# EAGLE schematic esp32-thing (EAGLE 9.5.2)
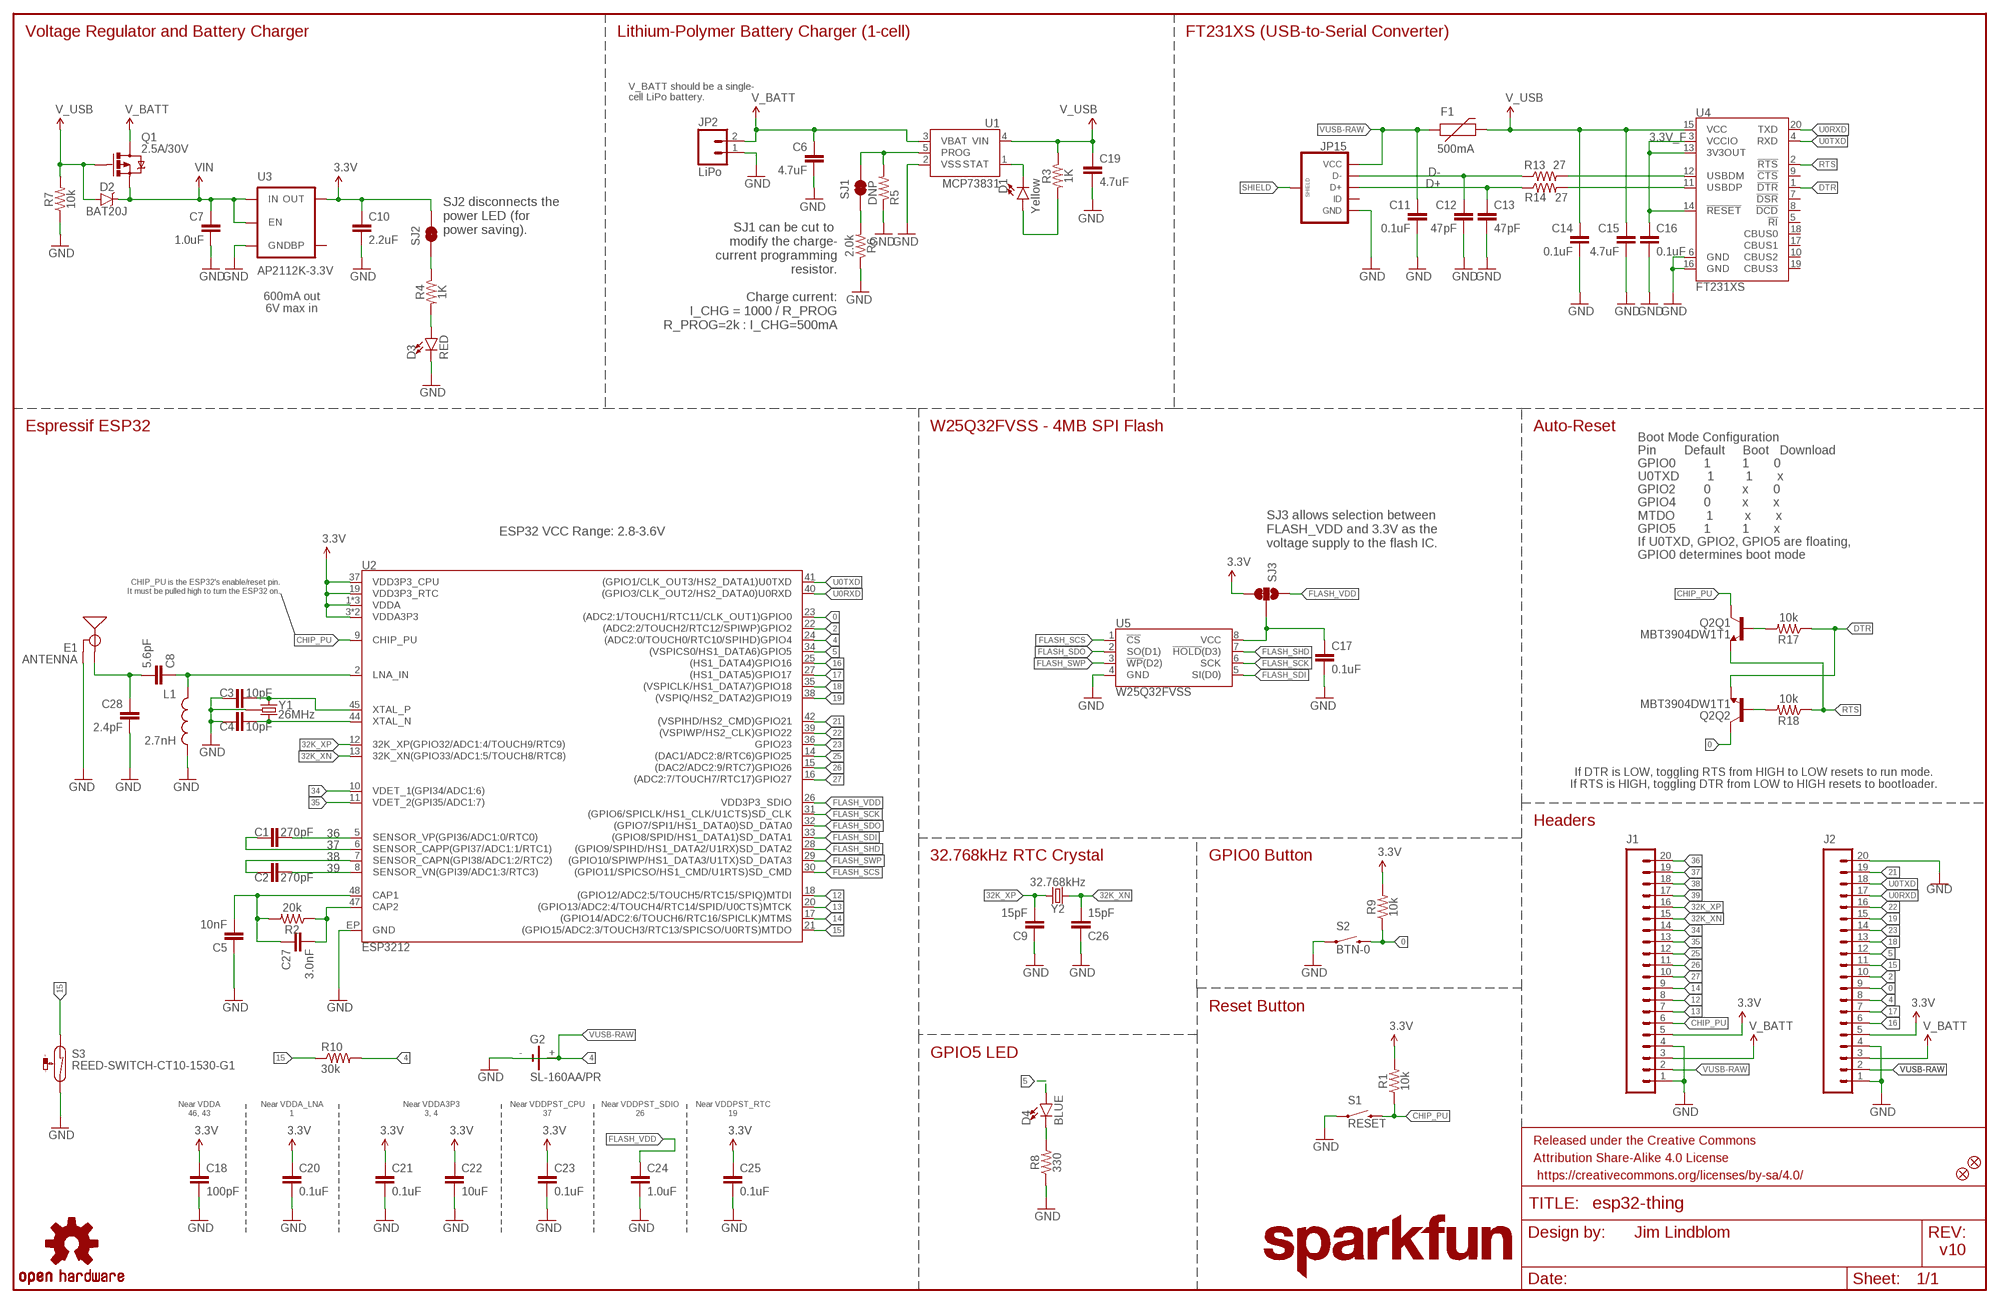
[diagram p0: schematic, sheet 1]

## Parts
C1  270pF  270PF-50V-5%(0603)  [0603]
C2  270pF  270PF-50V-5%(0603)  [0603]
C3  10pF  10PF-0603-50V-5%  [0603]
C4  10pF  10PF-0603-50V-5%  [0603]
C5  10nF  10NF-0603-50V-10%  [0603]
C6  4.7uF  4.7UF0603  [0603]
C7  1.0uF  1.0UF-0805-25V-(+80/-20%)  [0805]
C8  5.6pF  5.6PF-50V-5%(0603)  [0603]
C9  15pF  15PF-0603-50V-5%  [0603]
C10  2.2uF  2.2UF-0603-10V-20%  [0603]
C11  0.1uF  0.1UF-0603-25V-(+80/-20%)  [0603]
C12  47pF  47PF-0603-50V-5%  [0603]
C13  47pF  47PF-0603-50V-5%  [0603]
C14  0.1uF  0.1UF-0603-25V-(+80/-20%)  [0603]
C15  4.7uF  4.7UF-6.3V-10%(0603)0603  [0603-CAP]
C16  0.1uF  0.1UF-0603-25V-(+80/-20%)  [0603]
C17  0.1uF  0.1UF-0603-25V-(+80/-20%)  [0603]
C18  100pF  100PF-0603-50V-5%  [0603]
C19  4.7uF  4.7UF0603  [0603]
C20  0.1uF  0.1UF-0603-25V-(+80/-20%)  [0603]
C21  0.1uF  0.1UF-0603-25V-(+80/-20%)  [0603]
C22  10uF  10UF-0603-6.3V-20%  [0603]
C23  0.1uF  0.1UF-0603-25V-(+80/-20%)  [0603]
C24  1.0uF  1.0UF-0603-16V-10%  [0603]
C25  0.1uF  0.1UF-0603-25V-(+80/-20%)  [0603]
C26  15pF  15PF-0603-50V-5%  [0603]
C27  3.0nF  3.0NF-0603-50V-5%  [0603]
C28  2.4pF  2.4PF-0603-50V-5%  [0603]
D1  Yellow  LED-YELLOW0603  [LED-0603]
D2  BAT20J  DIODE-SCHOTTKY-BAT20J  [SOD-323]
D3  RED  LED-RED0603  [LED-0603]
D4  BLUE  LED-BLUE0603  [LED-0603]
E1  ANTENNA  ANTENNATRACE-TUNED  [TRACE_ANTENNA_2.4GHZ_25.7MM_TUNED]
F1  500mA  PTCSMD  [PTC-1206]
FD1  FIDUCIALUFIDUCIAL  [MICRO-FIDUCIAL]
FD2  FIDUCIALUFIDUCIAL  [MICRO-FIDUCIAL]
FRAME1  FRAME-LEDGER  [CREATIVE_COMMONS]
G2  SL-160AA/PR  [SL-160AA/PR]
J1  M20NOSILK  [1X20_NOSILK]
J2  M20NOSILK  [1X20_NOSILK]
JP2  LiPo  M02JST-PTH-2  [JST-2-PTH]
JP15  USB_MICROB_PLUGCONN-11752  [USB-B-MICRO-SMD_V03]
L1  2.7nH  INDUCTOR0603  [0603]
LOGO1  SFE_LOGO_NAME.2_INCH  [SFE_LOGO_NAME_.2]
LOGO2  OSHW-LOGOMINI  [OSHW-LOGO-MINI]
LOGO3  SFE_LOGO_NAME.2_INCH  [SFE_LOGO_NAME_.2]
Q1  2.5A/30V  MOSFET-PCHANNELDMG2307L  [SOT23-3]
Q2  MBT3904DW1T1  [SC70-6]
R1  10k  10KOHM-1/10W-1%(0603)0603  [0603]
R2  20k  20KOHM-0603-1/10W-1%  [0603]
R3  1K  1KOHM-1/10W-1%(0603)  [0603]
R4  1K  1KOHM-1/10W-1%(0603)  [0603]
R5  DNP  RESISTORPTH-1/6W  [1/6W-RES]
R6  2.0k  2.0KOHM1/10W5%(0603)  [0603]
R7  10k  10KOHM-0603-1/10W-1%  [0603]
R8  330  330OHM1/10W1%(0603)  [0603]
R9  10k  10KOHM-1/10W-1%(0603)0603  [0603]
R10  30k  R-US_M0805  [M0805]
R13  27  27OHM1/10W1%(0603)0603-RES  [0603]
R14  27  27OHM1/10W1%(0603)0603-RES  [0603]
R17  10k  10KOHM-0603-1/10W-1%  [0603]
R18  10k  10KOHM-0603-1/10W-1%  [0603]
S1  RESET  SWITCH-MOMENTARY-2SMD-4.6X2.8MM  [TACTILE_SWITCH_SMD_4.6X2.8MM]
S2  BTN-0  SWITCH-MOMENTARY-2SMD-4.6X2.8MM  [TACTILE_SWITCH_SMD_4.6X2.8MM]
S3  REED-SWITCH-CT10-1530-G1  [CT10-G1]
SJ1  JUMPER-PAD-2-NC_BY_TRACE  [PAD-JUMPER-2-NC_BY_TRACE_YES_SILK]
SJ2  JUMPER-PAD-2-NC_BY_TRACE  [PAD-JUMPER-2-NC_BY_TRACE_YES_SILK]
SJ3  JUMPER-PAD-3-2OF3_NC_BY_TRACE_SMALL  [PAD-JUMPER-3-2OF3_NC_BY_TRACE_YES_SILK_FULL_BOX]
U1  MCP73831  [SOT23-5]
U2  ESP3212  [QFN48-0.4MM]
U3  AP2112K-3.3V  V_REG_LDOSMD  [SOT23-5]
U4  FT231XS  [SSOP20_L]
U5  W25Q32FVSS  [SOIC-8]
Y1  26MHz  CRYSTAL-GROUNDED3.2X2.5  [CRYSTAL-SMD-3.2X2.5]
Y2  32.768kHz  CRYSTAL-32.768KHZSMD-3.2X1.5  [CRYSTAL-SMD-3.2X1.5MM]

## Nets
0: J2.9 Q2.6(Q2:C) R9.1 S2.3 S2.4 U2.23((ADC2:1/TOUCH1/RTC11/CLK_OUT1)GPIO0)
2: J2.10 U2.22((ADC2:2/TOUCH2/RTC12/SPIWP)GPIO2)
3.3V: C10.1 C18.1 C20.1 C21.1 C22.1 C23.1 C25.1 J1.5 J2.5 R1.2 R9.2 SJ2.2 SJ3.3 U2.1(VDDA) U2.3(VDDA3P3) U2.4(VDDA3P3) U2.19(VDD3P3_RTC) U2.37(VDD3P3_CPU) U2.43(VDDA) U2.46(VDDA) U3.5(OUT)
3.3V_F: C16.1 U4.3(VCCIO) U4.13(3V3OUT) U4.14(!RESET)
4: J2.8 U2.24((ADC2:0/TOUCH0/RTC10/SPIHD)GPIO4)
5: D4.A J2.12 U2.34((VSPICS0/HS1_DATA6)GPIO5)
12: J1.8 U2.18((GPIO12/ADC2:5/TOUCH5/RTC15/SPIQ)MTDI)
13: J1.7 U2.20((GPIO13/ADC2:4/TOUCH4/RTC14/SPID/U0CTS)MTCK)
14: J1.9 U2.17((GPIO14/ADC2:6/TOUCH6/RTC16/SPICLK)MTMS)
15: J2.11 U2.21((GPIO15/ADC2:3/TOUCH3/RTC13/SPICSO/U0RTS)MTDO)
16: J2.6 U2.25((HS1_DATA4)GPIO16)
17: J2.7 U2.27((HS1_DATA5)GPIO17)
18: J2.13 U2.35((VSPICLK/HS1_DATA7)GPIO18)
19: J2.15 U2.38((VSPIQ/HS2_DATA2)GPIO19)
21: J2.19 U2.42((VSPIHD/HS2_CMD)GPIO21)
22: J2.16 U2.39((VSPIWP/HS2_CLK)GPIO22)
23: J2.14 U2.36(GPIO23)
25: J1.12 U2.14((DAC1/ADC2:8/RTC6)GPIO25)
26: J1.11 U2.15((DAC2/ADC2:9/RTC7)GPIO26)
27: J1.10 U2.16((ADC2:7/TOUCH7/RTC17)GPIO27)
32K_XN: C26.2 J1.15 U2.13(32K_XN(GPIO33/ADC1:5/TOUCH8/RTC8)) Y2.P$2
32K_XP: C9.2 J1.16 U2.12(32K_XP(GPIO32/ADC1:4/TOUCH9/RTC9)) Y2.P$1
34: J1.14 U2.10(VDET_1(GPI34/ADC1:6))
35: J1.13 U2.11(VDET_2(GPI35/ADC1:7))
36: C1.2 J1.20 U2.5(SENSOR_VP(GPI36/ADC1:0/RTC0))
37: C1.1 J1.19 U2.6(SENSOR_CAPP(GPI37/ADC1:1/RTC1))
38: C2.1 J1.18 U2.7(SENSOR_CAPN(GPI38/ADC1:2/RTC2))
39: C2.2 J1.17 U2.8(SENSOR_VN(GPI39/ADC1:3/RTC3))
CAP_10N: C5.2 C27.1 R2.2 U2.48(CAP1)
CHIP_PU: J1.6 Q2.3(Q1:C) R1.1 S1.3 S1.4 U2.9(CHIP_PU)
D+: C13.1 JP15.D+ R14.1
D-: C12.1 JP15.D- R13.1
DTR: Q2.1(Q2:E) R17.1 U4.1(!DTR)
FLASH_SCK: U2.31((GPIO6/SPICLK/HS1_CLK/U1CTS)SD_CLK) U5.6(SCK)
FLASH_SCS: U2.30((GPIO11/SPICSO/HS1_CMD/U1RTS)SD_CMD) U5.1(!CS!)
FLASH_SDI: U2.33((GPIO8/SPID/HS1_DATA1)SD_DATA1) U5.5(SI(D0))
FLASH_SDO: U2.32((GPIO7/SPI1/HS1_DATA0)SD_DATA0) U5.2(SO(D1))
FLASH_SHD: U2.28((GPIO9/SPIHD/HS1_DATA2/U1RX)SD_DATA2) U5.7(!HOLD!(D3))
FLASH_SWP: U2.29((GPIO10/SPIWP/HS1_DATA3/U1TX)SD_DATA3) U5.3(!WP!(D2))
FLASH_VDD: C24.1 SJ3.1 U2.26(VDD3P3_SDIO)
GND: C3.1 C4.1 C5.1 C6.2 C7.2 C9.1 C10.2 C11.2 C12.2 C13.2 C14.2 C15.2 C16.2 C17.2 C18.2 C19.2 C20.2 C21.2 C22.2 C23.2 C24.2 C25.2 C26.1 C28.2 D3.C E1.GND E1.GND2(GND) G2.+ G2.- J1.1 J1.4 J2.1 J2.4 J2.20 JP2.1 JP15.GND L1.2 R5.1 R6.1 R7.1 R8.1 S1.1 S1.2 S2.1 S2.2 S3.2 U1.2(VSS) U2.EP(GND) U3.2(GND) U4.6(GND) U4.16(GND) U5.4(GND) Y1.2(GND) Y1.4(GND)
LNA_IN: C8.1 L1.1 U2.2(LNA_IN)
N$1: D4.C R8.2
N$2: D3.A R4.2
N$3: R4.1 SJ2.1
N$4: C27.2 R2.1 U2.47(CAP2)
N$5: R10.2
N$6: R10.1
N$7: R13.2 U4.12(USBDM)
N$8: R14.2 U4.11(USBDP)
N$9: D1.C U1.1(STAT)
N$10: Q2.5(Q1:B) R17.2
N$11: C17.1 SJ3.2 U5.8(VCC)
N$12: Q2.2(Q2:B) R18.2
N$13: C3.2 U2.45(XTAL_P) Y1.1
N$14: R5.2 SJ1.2 U1.5(PROG)
N$15: C4.2 U2.44(XTAL_N) Y1.3
N$16: R6.2 SJ1.1
N$17: D1.A R3.2
N$18: S3.1
RTS: Q2.4(Q1:E) R18.1 U4.2(!RTS)
SHIELD: JP15.SHIELD1(SHIELD) JP15.SHIELD2(SHIELD) JP15.SHIELD3(SHIELD)
TRACE_ANT: C8.2 C28.1 E1.ANT(SIGNAL)
U0RXD: J2.17 U2.40((GPIO3/CLK_OUT2/HS2_DATA0)U0RXD) U4.20(TXD)
U0TXD: J2.18 U2.41((GPIO1/CLK_OUT3/HS2_DATA1)U0TXD) U4.4(RXD)
V_BATT: C6.1 J1.3 J2.3 JP2.2 Q1.3(D) U1.3(VBAT)
V_USB: C14.1 C15.1 C19.1 D2.A F1.2 Q1.1(G) R3.1 R7.2 U1.4(VIN) U4.15(VCC)
VIN: C7.1 D2.C Q1.2(S) U3.1(IN) U3.3(EN)
VUSB-RAW: C11.1 F1.1 J1.2 J2.2 JP15.VBUS(VCC)
Unconnected: JP15.ID U3.4(BP) U4.5(!RI) U4.7(!DSR) U4.8(!DCD) U4.9(!CTS) U4.10(CBUS2) U4.17(CBUS1) U4.18(CBUS0) U4.19(CBUS3)

## Notes on the sheet
- Voltage Regulator and Battery Charger | Lithium-Polymer Battery Charger (1-cell) | FT231XS (USB-to-Serial Converter)
- V_BATT should be a single-
  cell LiPo battery.
- SJ1 can be cut to 
  modify the charge-
  current programming
  resistor.
- SJ2 disconnects the
  power LED (for 
  power saving).
- 600mA out
  6V max in
- Charge current:
  I_CHG = 1000 / R_PROG
  R_PROG=2k : I_CHG=500mA
- Espressif ESP32 | W25Q32FVSS - 4MB SPI Flash | Auto-Reset
- ESP32 VCC Range: 2.8-3.6V
- SJ3 allows selection between 
  FLASH_VDD and 3.3V as the
  voltage supply to the flash IC.
- Boot Mode Configuration
  Pin        Default     Boot   Download
  GPIO0        1         1       0
  U0TXD        1         1       x
  GPIO2        0         x       0
  GPIO4        0         x       x
  MTDO         1         x       x
  GPIO5        1         1       x
  If U0TXD, GPIO2, GPIO5 are floating, 
  GPIO0 determines boot mode
- CHIP_PU is the ESP32's enable/reset pin.
  It must be pulled high to turn the ESP32 on.
- If DTR is LOW, toggling RTS from HIGH to LOW resets to run mode.
  If RTS is HIGH, toggling DTR from LOW to HIGH resets to bootloader.
- Headers
- 32.768kHz RTC Crystal | GPIO0 Button
- Reset Button
- GPIO5 LED
- Near VDDA
  46, 43
- Near VDDA_LNA
  1
- Near VDDA3P3
  3, 4
- Near VDDPST_CPU
  37
- Near VDDPST_SDIO
  26
- Near VDDPST_RTC
  19
- Jim Lindblom
- v10

## Library data of the parts
C1 C2 = esp32-thing-temp:270PF-50V-5%(0603): CAP-13339; PROD_ID: CAP-13339
C3 C4 = SparkFun-Capacitors:10PF: 10pF ceramic capacitors A capacitor is a passive two-terminal electrical component used to store electrical energy temporarily in an electric field.; PROD_ID: CAP-11812
C5 = SparkFun-Capacitors:10NF: 0.01uF/10nF/10,000pF ceramic capacitors A capacitor is a passive two-terminal electrical component used to store electrical energy temporarily in an electric field. CAP-09321; PROD_ID: CAP-00867
C6 C19 = SparkFun-Capacitors:4.7UF: 4.7µF ceramic capacitors A capacitor is a passive two-terminal electrical component used to store electrical energy temporarily in an electric field.; PROD_ID: CAP-08280
C7 = SparkFun-Capacitors:1.0UF: 1µF ceramic capacitors A capacitor is a passive two-terminal electrical component used to store electrical energy temporarily in an electric field.; PROD_ID: CAP-11625
C8 = esp32-thing-temp:5.6PF-50V-5%(0603): CAP-12456; PROD_ID: CAP-12456
C9 C26 = SparkFun-Capacitors:15PF: 15pF ceramic capacitors A capacitor is a passive two-terminal electrical component used to store electrical energy temporarily in an electric field.; PROD_ID: CAP-07881
C10 = SparkFun-Capacitors:2.2UF: 2.2µF ceramic capacitors A capacitor is a passive two-terminal electrical component used to store electrical energy temporarily in an electric field.; PROD_ID: CAP-07888
C11 C14 C16 C17 C20 C21 C23 C25 = SparkFun-Capacitors:0.1UF: 0.1µF ceramic capacitors A capacitor is a passive two-terminal electrical component used to store electrical energy temporarily in an electric field.; PROD_ID: CAP-00810
C12 C13 = SparkFun-Capacitors:47PF: 47pF ceramic capacitors A capacitor is a passive two-terminal electrical component used to store electrical energy temporarily in an electric field.; PROD_ID: CAP-08913
C15 = SparkFun-Capacitors:4.7UF-6.3V-10%(0603): CAP-08280; PROD_ID: CAP-08280
C18 = SparkFun-Capacitors:100PF: 100pF/0.1nF ceramic capacitors A capacitor is a passive two-terminal electrical component used to store electrical energy temporarily in an electric field.; PROD_ID: CAP-07883
C22 = SparkFun-Capacitors:10UF: 10.0µF ceramic capacitors A capacitor is a passive two-terminal electrical component used to store electrical energy temporarily in an electric field.; PROD_ID: CAP-11015
C24 = SparkFun-Capacitors:1.0UF: 1µF ceramic capacitors A capacitor is a passive two-terminal electrical component used to store electrical energy temporarily in an electric field.; PROD_ID: CAP-00868
C27 = esp32-thing-temp:3.0NF: 3.0nF (3nF, 3000pF) ceramic capacitors A capacitor is a passive two-terminal electrical component used to store electrical energy temporarily in an electric field.; PROD_ID: CAP-13515
C28 = esp32-thing-temp:2.4PF: 2.4pF ceramic capacitors A capacitor is a passive two-terminal electrical component used to store electrical energy temporarily in an electric field.; PROD_ID: CAP-13541
D1 = SparkFun-LED:LED-YELLOW: Yellow SMD LEDs LilyPad 1206- DIO-09909 0603- DIO-09003 "SMART" means more efficient and expensive; PROD_ID: DIO-09003
D2 = SparkFun-DiscreteSemi:DIODE-SCHOTTKY: Schottky diodes in SFE's production catalog BAT20J 1A 23V 0.62Vf RB751 120mA 40V 0.37Vf PMEG4005EJ 0.5A 40V 0.42Vf MBRA140 1A 40V 0.5Vf B340A 3A 40V SMA; PROD_ID: DIO-11623
D3 = SparkFun-LED:LED-RED: Red SMD LED Used in manufacturing of most products at SparkFun 0603 - SMD 0603 package Forward Voltage: 1.9V Forward Current: 20mA Datasheet: [Product Link] <http://docs.avagotech.com/docs/AV02-0551EN> 0603 SMART - SMD 0603 SMART package ( more efficient and expensive) Forward Voltage: 1.8V Forward Current: 20mA Datasheet: [Product Link] <http://www.osram-os.com/Graphics/XPic2/00077099_0.pdf> 1206 - SMD 1206 package Forward Voltage: 2V Forward Current: 20mA Datasheet: [Product Link] <https://www.sparkfun.com/datasheets/DevTools/LilyPad/Q150OVS4.pdff> 1206 LilyPad - SMD 1206 LilyPad package Forward Voltage: 2V Forward Current: 20mA Datasheet: [Product Link] <https://www.sparkfun.com/datasheets/DevTools/LilyPad/Q150OVS4.pdf>; PROD_ID: DIO-00819
D4 = SparkFun-LED:LED-BLUE: Blue SMD LED Used in manufacturing of various products at SparkFun 0603 - SMD 0603 package Manufacturer: Rohm Semiconductor Forward Voltage: 2.9V Forward Current: 5mA Wavelength: 470nm Digikey: [Product Link] <http://www.digikey.com/product-detail/en/SMLE12BC7TT86/511-1589-2-ND/1641808> 1206 - SMD1206 package Manufacturer:Lite-On Inc. Forward Voltage: 3.3V Forward Current: 20mA Wavelength: 468nm Digikey: [Product Link] <http://www.digikey.com/product-detail/en/lite-on-inc/LTST-C150TBKT/160-1643-1-ND/573584>; PROD_ID: DIO-08575
E1 = esp32-thing-temp:ANTENNA: Chip antenna Chip antenna with ground or secondary connection. Common with larger metal RF connectors.
F1 = SparkFun-PowerIC:PTC: Resettable Fuse PTC Resettable Fuse. Spark Fun Electronics SKU : COM-08357; PROD_ID: RES-11150
FD1 FD2 = SparkFun-Aesthetics:FIDUCIAL: Fiducial Alignment Points Various fiducial points for machine vision alignment.
FRAME1 = SparkFun-Aesthetics:FRAME-LEDGER: Schematic Frame Standard 11x14 US Ledger frame
G2 = battery:SL-160AA/PR: LI BATTERY Sonnenschein
J1 J2 = SparkFun-Connectors:M20: 1x20 .1" header This is just like the LOCK variant in that the holes are staggared by 5 mil, but except for the last two holes. They are not altered from the "standard" footprint layout. This is used for a special purpose on the layout of our Graphic LCD Backpack. Make sure you want to use this device before selecting it for you project!
JP2 = SparkFun-Connectors:M02: Standard 2-pin 0.1" header. Use with - straight break away headers ( PRT-00116) - right angle break away headers (PRT-00553) - swiss pins (PRT-00743) - machine pins (PRT-00117) - female headers (PRT-00115) Molex polarized connector foot print use with: PRT-08233 with associated crimp pins and housings. 2.54_SCREWTERM for use with PRT-10571. 3.5mm Screw Terminal footprints for PRT-08084 5mm Screw Terminal footprints for use with PRT-08432; PROD_ID: CONN-09863; SKU: PRT-09914
JP15 = SparkFun-Connectors:USB_MICROB_PLUG: USB Micro-B connectors Some male, some female. Watch your step!; PROD_ID: CONN-11752
L1 = SparkFun-Passives:INDUCTOR: Inductors Basic Inductor/Choke - 0603 and 1206. Footprints are not proven and vary greatly between part numbers. INDUCTOR POWER 3.3UH 4.0A SMD 0.197" L x 0.197" W x 0.177" H (5.00mm x 5.00mm x 4.50mm); PROD_ID: NDUC-08762
LOGO1 LOGO3 = SparkFun-Aesthetics:SFE_LOGO_NAME: SFE Logo, name only This is the SparkFun name logo. The logo on the schematic will always be the same size; the package variant is the height of the flame part of the logo (or the height the flame would be, if it were drawn). Default layer for the logo on the board is tSilk.
LOGO2 = SparkFun-Aesthetics:OSHW-LOGO: Open Source Hardware Logo This logo indicates the piece of hardware it is found on incorporates a OSHW license and/or adheres to the definition of open source hardware found here: http://freedomdefined.org/OSHW
Q1 = SparkFun-DiscreteSemi:MOSFET-PCHANNEL: Generic PMOSFET IRLML2244 - TRANS-11153 (SOT-23 -20V -4.3A) (1.Gate 2.Source 3.Drain) FQP27P06 - COM-10349 <http://www.sparkfun.com/products/10349> (TO-220 -60V -27A) (1.Gate 2.Source 3.Drain); PROD_ID: TRANS-11308
Q2 = esp32-thing-temp:MBT3904DW1T1: MBT3904DW1 Dual NPN Transistors The MBT3904W1 puts two general purpose 3904 NPN transistors in a single package. Datasheet <http://www.onsemi.com/pub_link/Collateral/MBT3904DW1T1-D.PDF>; PROD_ID: TRANS-13337
R1 R9 = SparkFun-Resistors:10KOHM-1/10W-1%(0603): RES-00824; PROD_ID: RES-00824; VALUE: 10K
R2 = SparkFun-Resistors:20KOHM: 20kΩ resistor A resistor is a passive two-terminal electrical component that implements electrical resistance as a circuit element. Resistors act to reduce current flow, and, at the same time, act to lower voltage levels within circuits. - Wikipedia; PROD_ID: RES-09383
R3 R4 = SparkFun-Resistors:1KOHM-1/10W-1%(0603): RES-07856; PROD_ID: RES-07856
R5 = SparkFun-Passives:RESISTOR: Resistor Basic schematic elements and footprints for 0603, 1206, and PTH resistors.
R6 = SparkFun-Resistors:2.0KOHM1/10W5%(0603): RES-08296; PROD_ID: RES-08296
R7 R17 R18 = SparkFun-Resistors:10KOHM: 10kΩ resistor A resistor is a passive two-terminal electrical component that implements electrical resistance as a circuit element. Resistors act to reduce current flow, and, at the same time, act to lower voltage levels within circuits. - Wikipedia; PROD_ID: RES-00824
R8 = SparkFun-Resistors:330OHM1/10W1%(0603): RES-00818; PROD_ID: RES-00818
R10 = rcl:R-US_: RESISTOR, American symbol; SPICEPREFIX: R
R13 R14 = SparkFun-Resistors:27OHM1/10W1%(0603): RES-09334; PROD_ID: RES-09334
S1 S2 = SparkFun-Electromechanical:SWITCH-MOMENTARY-2: Various NO switches- pushbuttons, reed, etc; PROD_ID: SWCH-13065
S3 = switch-reed:REED-SWITCH-: Reed Sensor; MF: COTO TECHNOLOGY; MPN: CT10-1530-G1; OC_FARNELL: 1081696
SJ1 SJ2 = SparkFun-Passives:JUMPER-PAD-2-NC_BY_TRACE
SJ3 = SparkFun-Passives:JUMPER-PAD-3-2OF3_NC_BY_TRACE
U1 = SparkFun-PowerIC:MCP73831: Miniature single cell, fully integrated Li-Ion, Li-polymer charge management controller http://ww1.microchip.com/downloads/en/DeviceDoc/20001984g.pdf IC-09995; PROD_ID: IC-09995
U2 = esp32-thing-temp:ESP3212; PROD_ID: IC-13338
U3 = SparkFun-PowerIC:V_REG_LDO: Voltage Regulator LDO Standard 150mA LDO voltage regulator in SOT-23 layout. Micrel part MIC5205. BP (by-pass) pin is used to lower output noise with 470pF cap.; PROD_ID: VREG-12457
U4 = SparkFun-DigitalIC:FT231X: FTDI FT231X Full Speed USB to Full-handshake UART This USB2.0 Full Speed IC offers a compact bridge to full handshake UART interfaces. The device is a UART, capable of operating up to 3MBaud, with low power consumption (8mA). The FT231X includes the complete FT-X series feature set and enables USB to be added into a system design quickly and easily over a UART interface.; PROD_ID: IC-11524
U5 = SparkFun-DigitalIC:W25Q32FV: Winbond W25Q32FV 32Mbit (4MB) Flash The W25Q32FV support the standard Serial Peripheral Interface (SPI), Dual/Quad I/O SPI as well as 2-clocks instruction cycle Quad Peripheral Interface (QPI). Datasheet <http://www.winbond.com/resource-files/w25q32fv%20revh%20091613.pdf>; PROD_ID: IC-13229
Y1 = things:CRYSTAL-GROUNDED; PROD_ID: XTAL-12454
Y2 = SparkFun-Clocks:CRYSTAL-32.768KHZ: 32.768kHz Crystal Frequency: 32.768kHz Frequency Stability: ±20ppm Load Capacitance: 12.5pF (PTH-2X6 & SMD-3.2X1.5), 6pF (SMD-2X6); PROD_ID: XTAL-13062